# EAGLE design XLR-F Breakout (EAGLE 9.4.2)
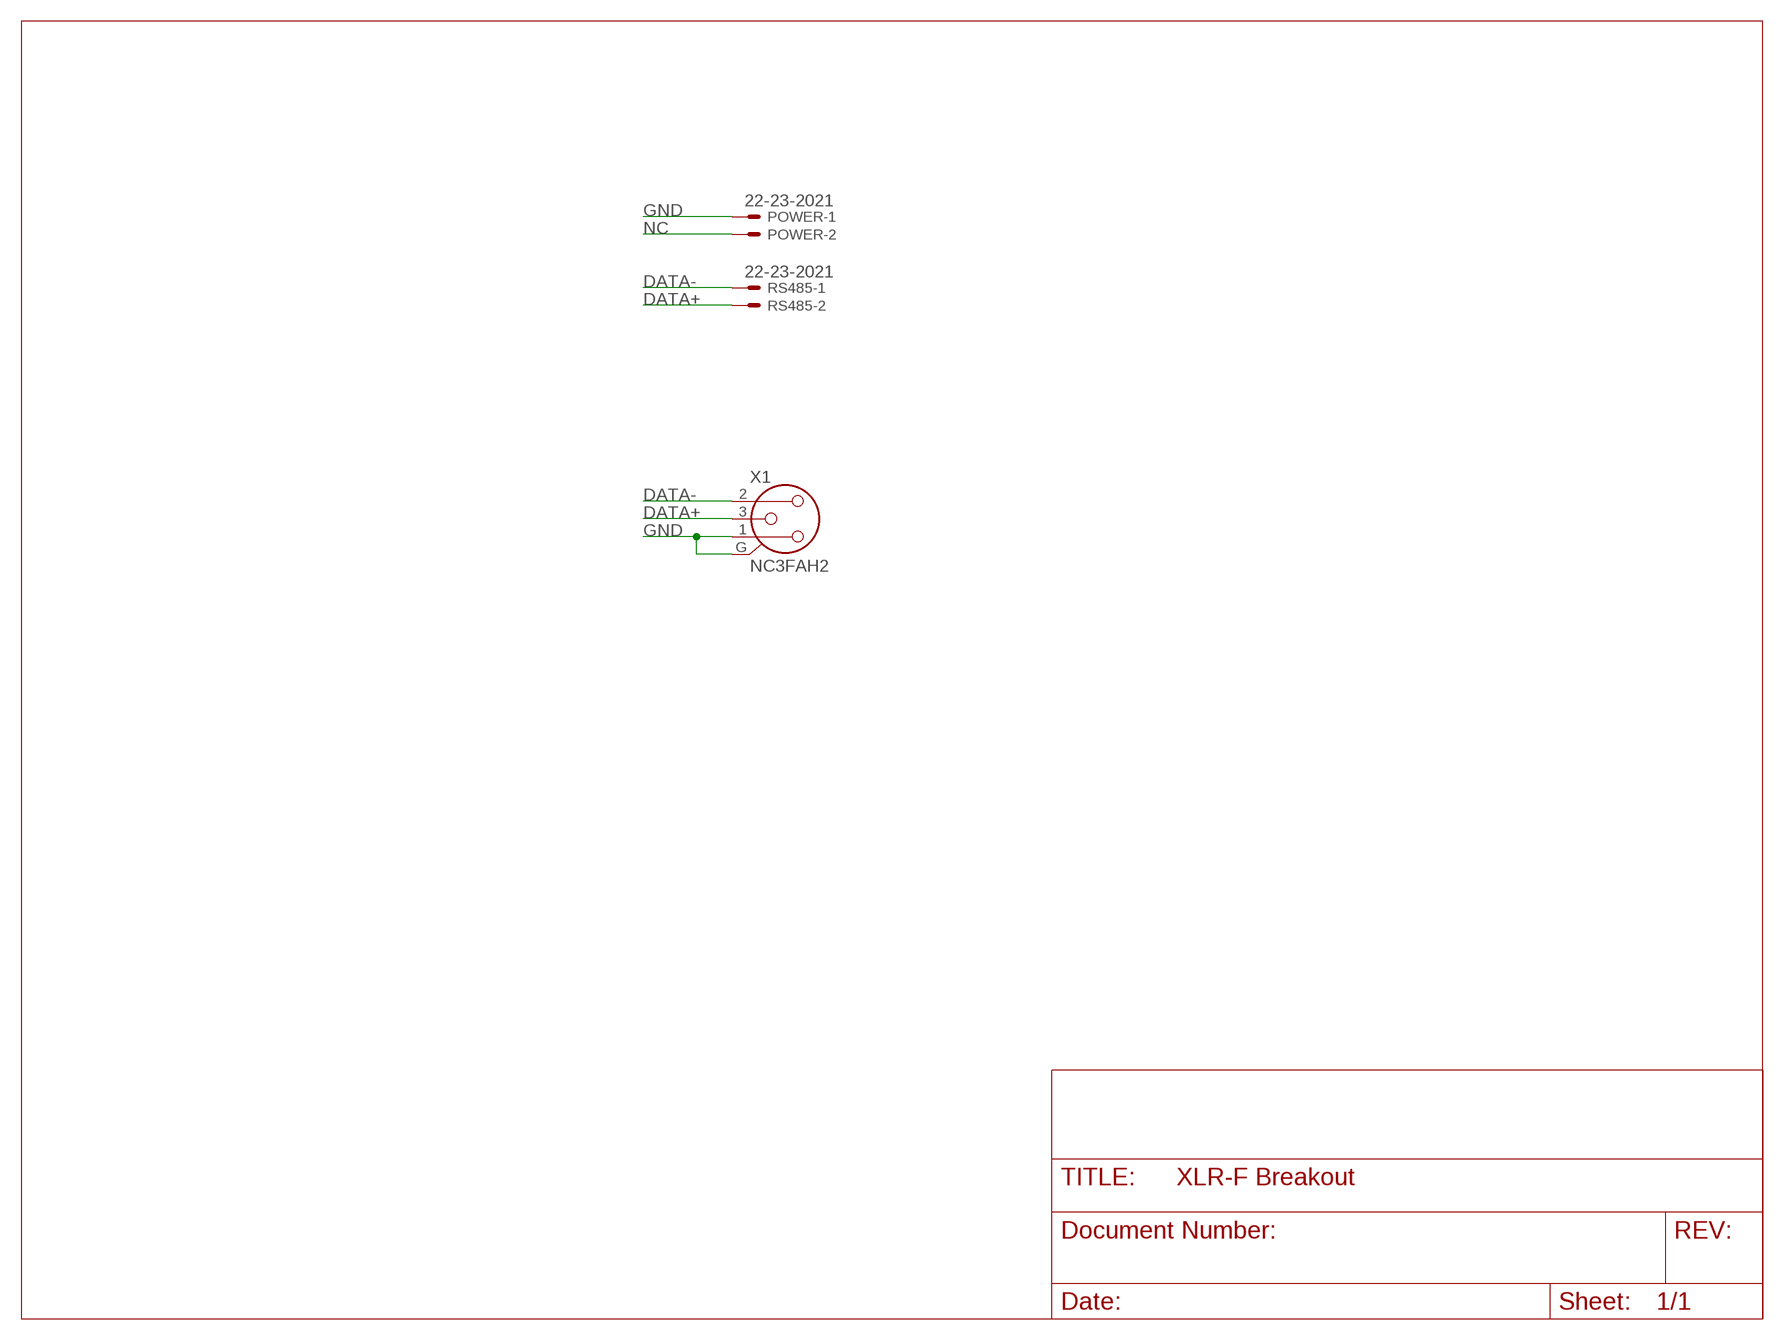
[diagram p0: schematic, sheet 1]

## Parts
POWER  22-23-2021  [22-23-2021]
RS485  22-23-2021  [22-23-2021]
X1  NC3FAH2  [NC3FAH2]

## Nets
DATA+: RS485.2 X1.3
DATA-: RS485.1 X1.2
GND: POWER.1 X1.1 X1.G
NC: POWER.2

## Library data of the parts
POWER RS485 = con-molex:22-23-2021: .100" (2.54mm) Center Header - 2 Pin; MF: MOLEX; MPN: 22-23-2021; OC_FARNELL: 1462926; OC_NEWARK: 25C3832
X1 = con-neutrik_ag:NC3: Neutrik Audio Connector XLR SERIES Stereo 1/4" jack Source: www.neutrik.com/; MPN: NC3FAH2; OC_FARNELL: unknown; OC_NEWARK: 27B4208

## Board
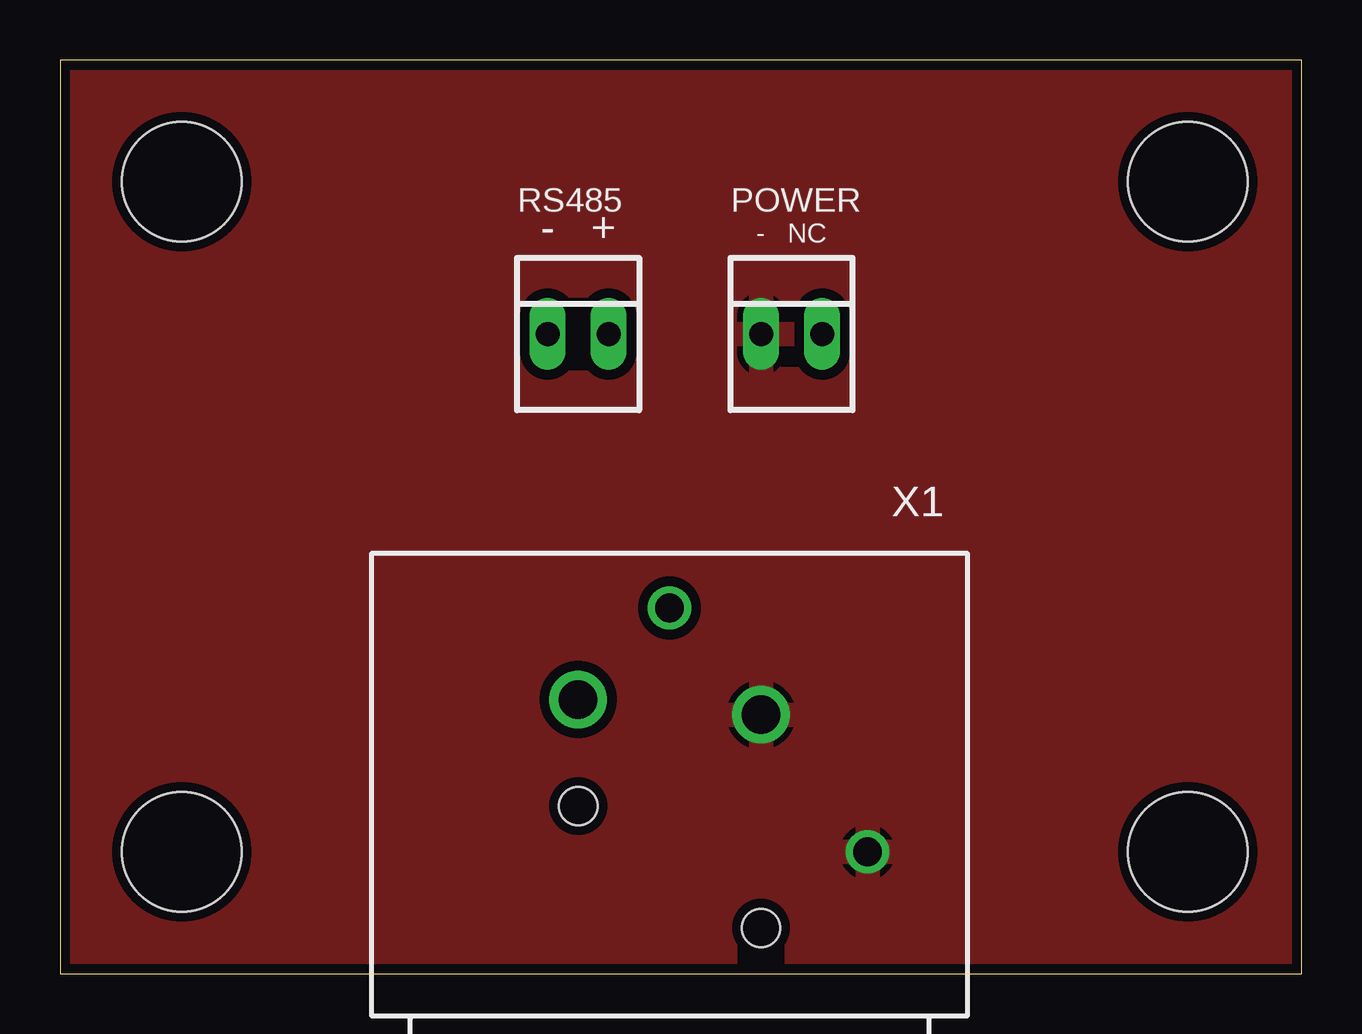
[diagram p1: board, top side]
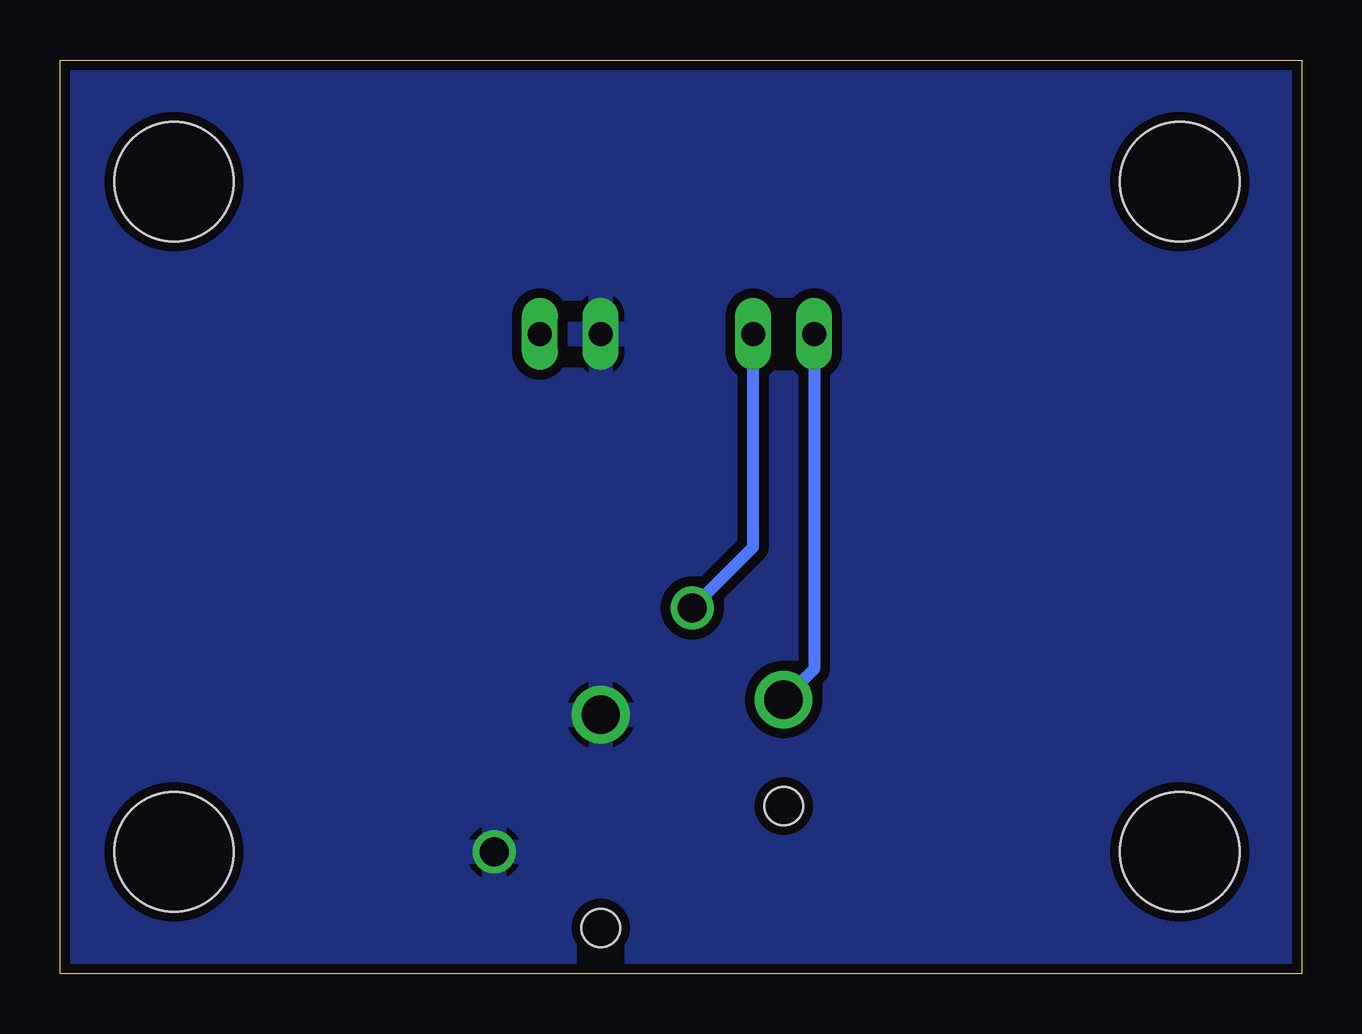
[diagram p2: board, bottom side, seen from below]

Size 51.74 x 38.09 mm. Coordinates in mm from the lower left corner, seen from the top.
Outline: 0,0 51.74,0 51.74,38.09 0,38.09 0,0
Copper layers (1*16): Top 0.035559375mm / dielectric 1.6mm / Bottom 0.035559375mm
Design rules "default": minimum track width 6mil, minimum drill 10mil, track to track 6mil, track to pad 6mil, pad to pad 6mil, via to via 6mil, smd to smd 6mil, copper to edge 15mil, drill to drill 6mil, minimum pad ring 5mil, minimum via ring 5mil, stop-mask expansion 2.5mil, vias tented up to drill 0mil, thermal gap 10mil
Holes 4.98 mm at 5.08,5.08 46.99,5.08 5.08,33.02 46.99,33.02

### Footprints (pad centres in the part's own frame; a part is rotated, then mirrored left to right if it is on the bottom)
22-23-2021 = drill 1 long: 1 -1.27,0; 2 1.27,0
NC3FAH2 = drill 1.6: 1 -3.81,0.635; 2 3.81,0 | drill 1.2: 3 0,-3.815; G -8.25,6.355 | hole 1.6: -3.81,9.525; 3.81,4.445

### Placement (x,y rotation side)
POWER  30.48,26.67 0 top
RS485  21.59,26.67 0 top
X1  25.4,11.43 180 top

### Tracks (layer width: path | path; a pad name or v marks a point on that pad's centre or on a via)
DATA+
  Bottom 0.508: X1.3 22.86,17.79 RS485.2
DATA-
  Bottom 0.508: RS485.1 20.32,12.7 X1.2
GND
  pour Top (isolate 0.406): 0,38.1 52.07,38.1 52.07,0 0,0
  pour Bottom (isolate 0.406): 0,38.1 52.07,38.1 52.07,3.81 53.34,2.54 53.34,0 0,0

### Text on the board
tNames: - + | - NC